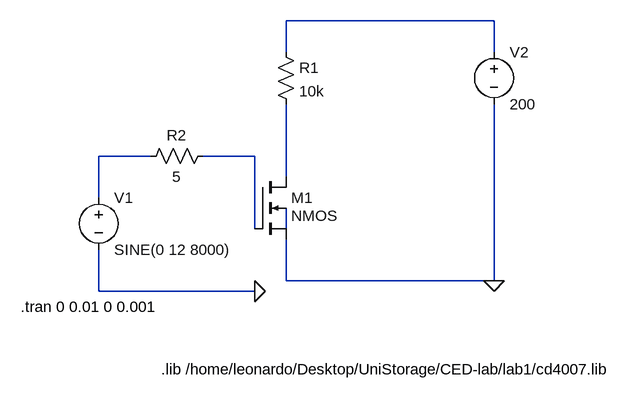
[diagram p0: schematic testigbt.asc]
testigbt.asc, the LTspice schematic file:
Version 4
SHEET 1 880 680
WIRE 496 48 176 48
WIRE 176 96 176 48
WIRE 496 96 496 48
WIRE -32 256 -112 256
WIRE 128 256 48 256
WIRE 176 288 176 176
WIRE -112 320 -112 256
WIRE 128 368 128 256
WIRE 176 368 176 336
WIRE 176 448 176 384
WIRE 496 448 496 176
WIRE 496 448 176 448
WIRE -112 464 -112 400
WIRE 128 464 -112 464
FLAG 496 448 0
FLAG 128 464 0
SYMBOL res 160 80 R0
SYMATTR InstName R1
SYMATTR Value 10k
SYMBOL voltage -112 304 R0
WINDOW 123 0 0 Left 0
WINDOW 39 0 0 Left 0
SYMATTR InstName V1
SYMATTR Value SINE(0 12 8000)
SYMBOL voltage 496 80 R0
WINDOW 123 0 0 Left 0
WINDOW 39 0 0 Left 0
SYMATTR InstName V2
SYMATTR Value 200
SYMBOL res 64 240 R90
WINDOW 0 0 56 VBottom 2
WINDOW 3 32 56 VTop 2
SYMATTR InstName R2
SYMATTR Value 5
SYMBOL nmos4 128 288 R0
WINDOW 3 56 60 Left 2
SYMATTR InstName M1
SYMATTR Value2 L=5u W=170u Ad=8500p As=8500p Pd=440u Ps=440u NRD=0.1 NRS=0.1
TEXT -232 488 Left 2 !.tran 0 0.01 0 0.001
TEXT -16 584 Left 2 !.lib /home/leonardo/Desktop/UniStorage/CED-lab/lab1/cd4007.lib

The netlist it stands for:
* testigbt.asc
R1 N001 N004 10k
V1 N002 0 SINE(0 12 8000)
V2 N001 0 200
R2 N003 N002 5
M1 N004 N003 0 N005 NMOS L=5u W=170u Ad=8500p As=8500p Pd=440u Ps=440u NRD=0.1 NRS=0.1
.model NMOS NMOS
.model PMOS PMOS
.lib standard.mos
.tran 0 0.01 0 0.001
.lib /home/leonardo/Desktop/UniStorage/CED-lab/lab1/cd4007.lib
.backanno
.end